# EasyEDA Pro project ProPrj_WatcheRobot2.0openSource_2026-06-17.epro, schematic 脚底充电板原理图
Assembly Variant: Basic; Board Name: Board1; Create Date: 2026-04-27; Page Name: P1; Project Name: WatcheRobot2.0; Schematic Name: Schematic3; Update Date: 2026-04-27; Company: 嘉立创EDA; Page Size: A4; Version: V1.0
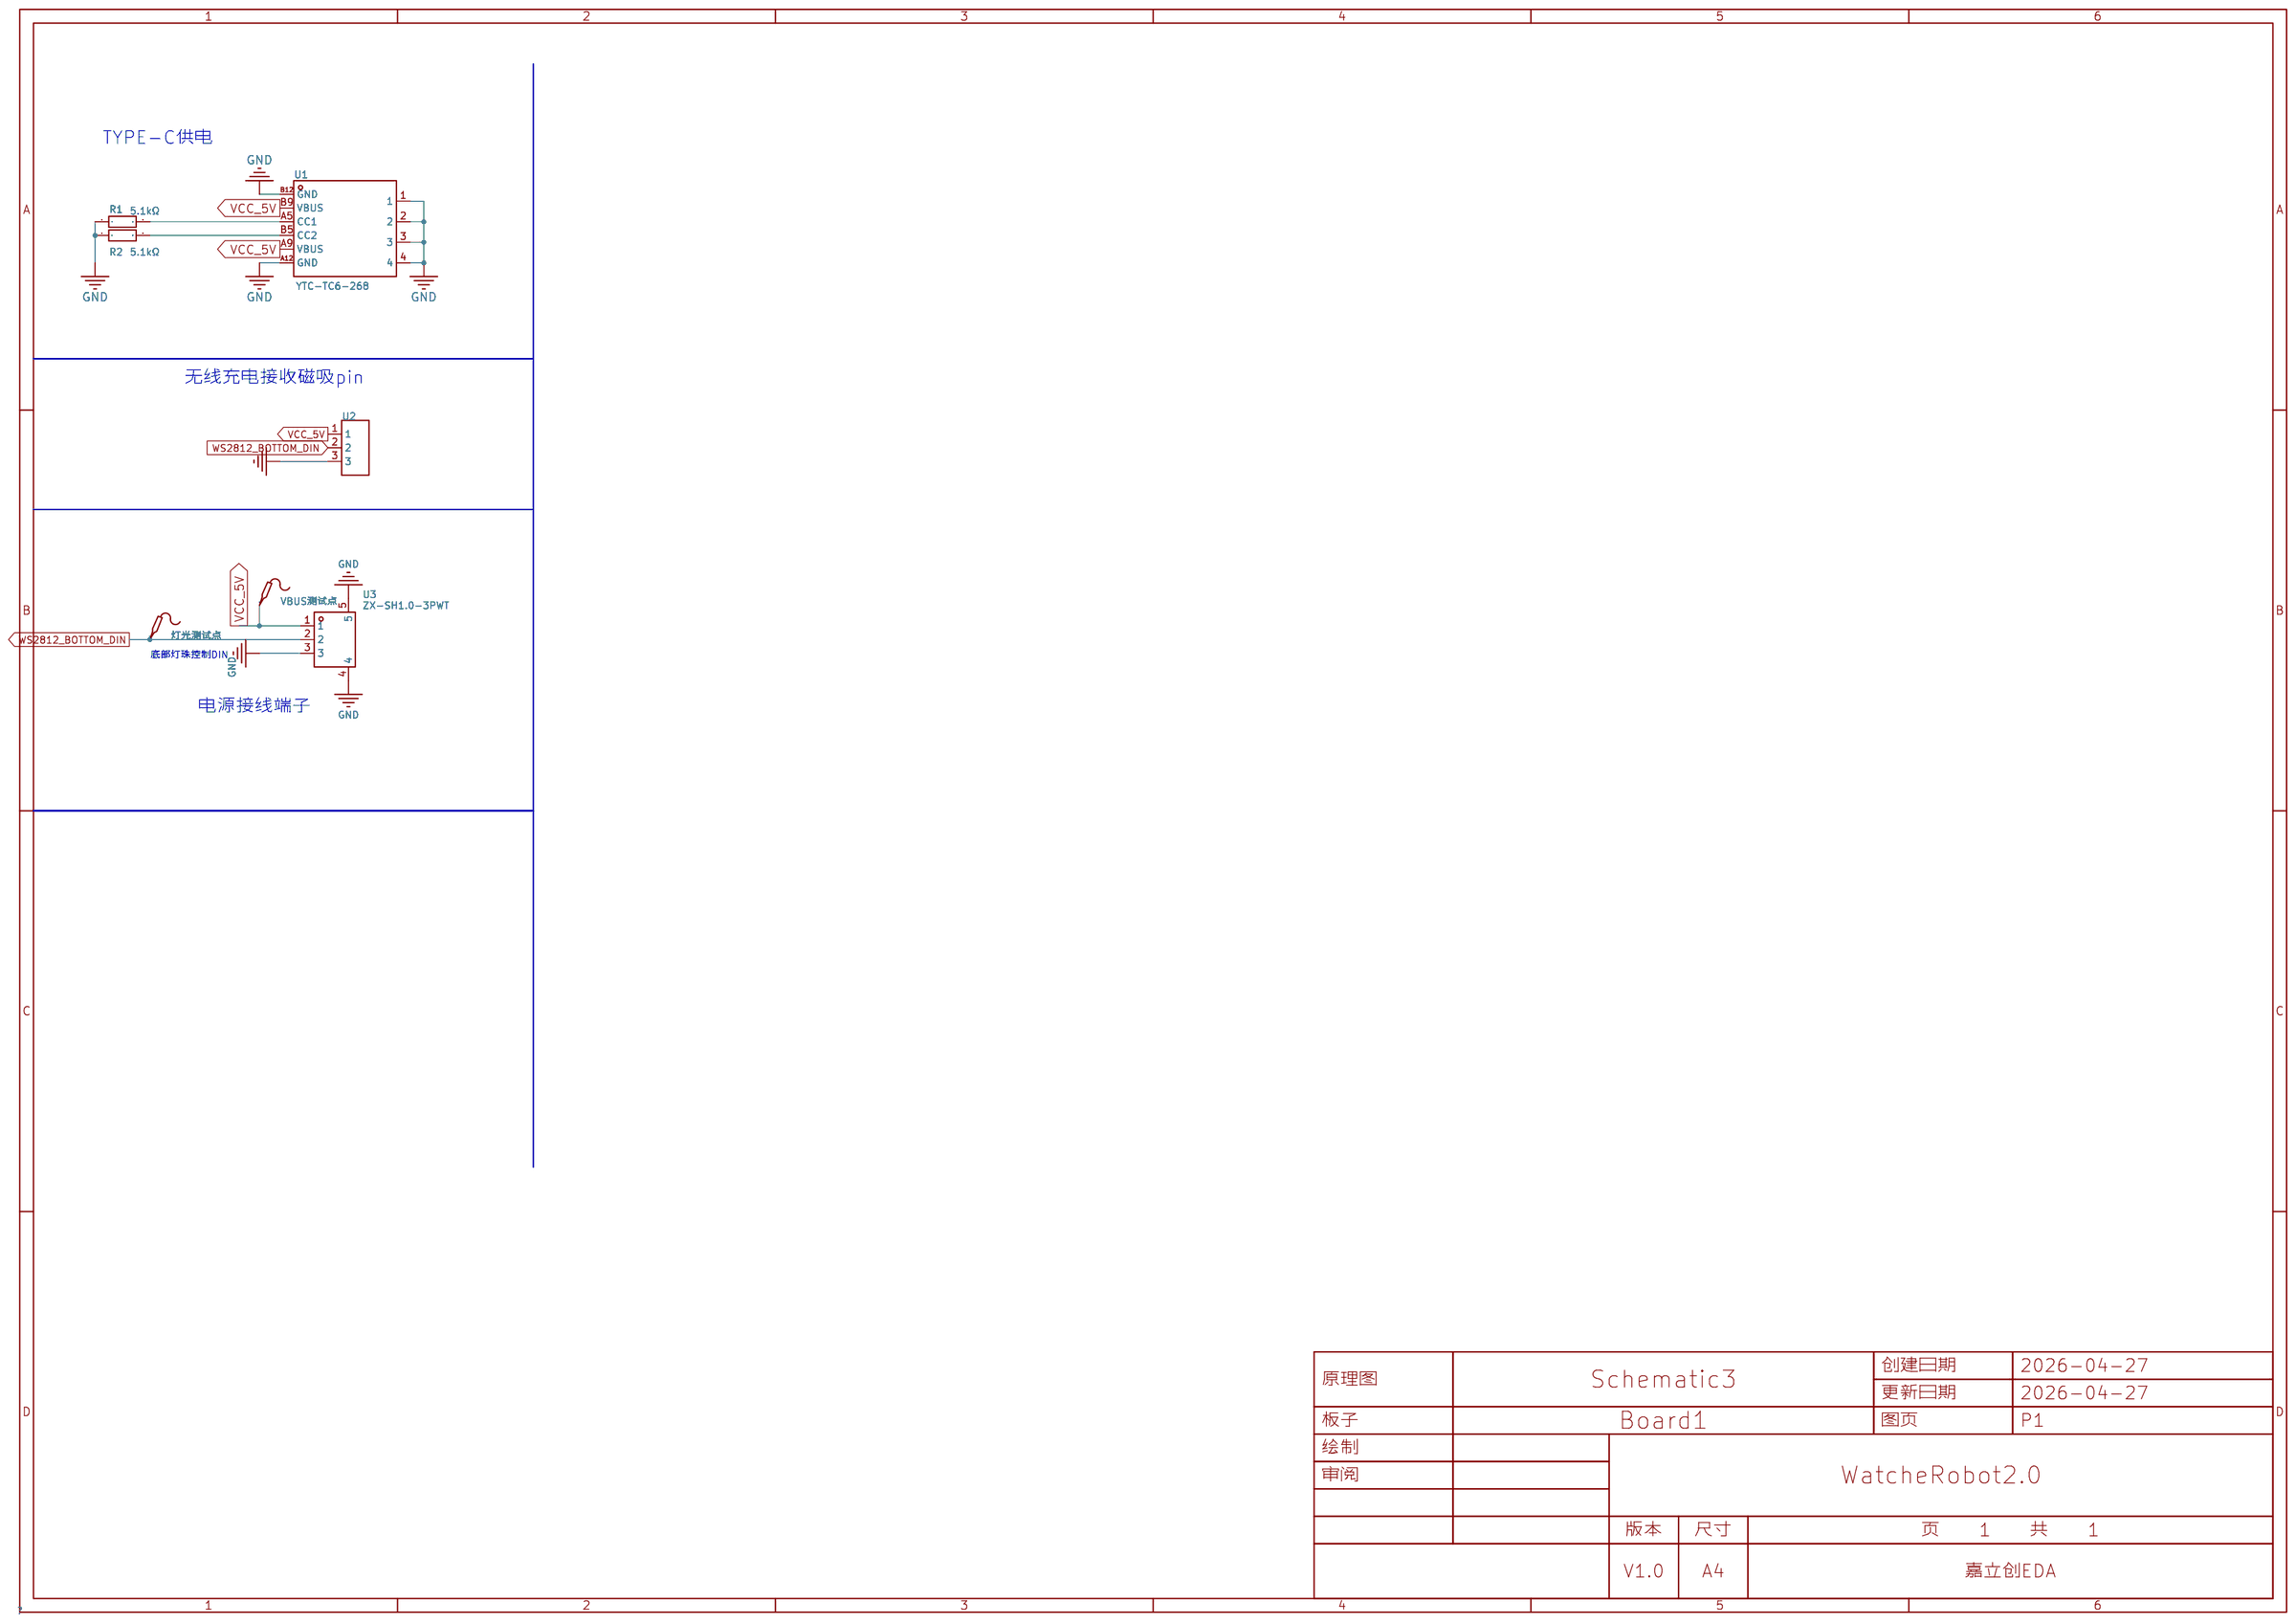
[diagram p0: schematic sheet]

## Parts
R1  5.1kΩ  [R0603_3]
R2  5.1kΩ  [R0603_3]
U1  YTC-TC6-268  [TYPE-C-SMD_YIYUAN_YTC-TC6-268]
U2  PR5L4015-3P-C-F  [CONN-TH_PR5L4015-3P-C-F]
U3  ZX-SH1.0-3PWT  [CONN-SMD_3P-P1.00_MEGASTAR_ZX-SH1.0-3PWT]
VBUS测试点  -  [Test-Point-0.5mm]
灯光测试点  -  [Test-Point-0.5mm]

## Library data of the parts
R1 R2 = 0603WAF5101T5E: 电阻类型:厚膜电阻;阻值:5.1kΩ;精度:±1%;功率:100mW;温度系数:±100ppm/;最大工作电压:75V;工作温度范围:-55~+155;; LCSC Part Name: 5.1kΩ ±1% 100mW; Supplier Part: C23186; Manufacturer: UNI-ROYAL(厚声); Supplier Footprint: 0603; JLCPCB Part Class: 基础库; Datasheet: https://atta.szlcsc.com/upload/public/pdf/source/20200306/C422600_1E6D84923E4A46A82E41ADD87F860B5C.pdf; Supplier: LCSC; Type: 厚膜电阻; Tolerance: ±1%; Power(Watts): 100mW; Temperature Coefficient: ±100ppm/; Overload Voltage (Max): 75V; Operating Temperature Range: -55~+155
U1 = YTC-TC6-268: 连接器类型:Type-C;公母:母座;触点数量:6;; LCSC Part Name: Type-C 母座; Supplier Part: C5260484; Manufacturer: YIYUAN(怡远); Supplier Footprint: SMD; JLCPCB Part Class: 扩展库; Datasheet: https://atta.szlcsc.com/upload/public/pdf/source/20221115/94102468E8C367463F1D717839C68408.pdf; Supplier: LCSC; Connector Type: Type-C; Gender: 母座; Number of Contacts: 6
U2 = PR5L4015-3P-C-F: 类型:弹簧顶针(POGO PIN);总PIN数:3P;间距:2.54mm;全长/全高:-;工作高度:-;接触电阻:-;弹性寿命:10000次;额定电流:2A;额定电压:12V;触头材质:黄铜;触头镀层:金;工作温度:-40℃~+85℃;; LCSC Part Name: 2.54-3P磁吸弹簧探针连接器母座POGOPIN适配PR5L5015-3P-C-H; Supplier Part: C41361290; Manufacturer: SAMZO(三佐); JLCPCB Part Class: Extended Part; Datasheet: https://item.szlcsc.com/datasheet/PR5L4015-3P-C-F/43105441.html; Supplier: LCSC; Type: 弹簧顶针(POGO PIN); Number of Pins: 3P; Pitch: 2.54mm; Elastic Life: 10000次; Current Rating: 2A; Voltage Rating: 12V; Contact Material: 黄铜; Contact Plating: 金; Operating Temperature: -40℃~+85℃
U3 = ZX-SH1.0-3PWT: 插针结构:1x3P;间距:1mm;安装方式:卧贴;参考系列:SH;总PIN数:3P;排数:1;每排PIN数:3;行距:-;额定电流:1A;触头材质:黄铜;触头镀层:锡;工作温度:-40℃~+85℃;; LCSC Part Name: 1x3P 间距:1mm 卧贴 系列:SH; Supplier Part: C7430445; Manufacturer: Megastar(兆星); Supplier Footprint: SMD,P=1mm,卧贴; JLCPCB Part Class: Extended Part; Datasheet: https://item.szlcsc.com/datasheet/ZX-SH1.0-3PWT/8430314.html; Supplier: LCSC; Pins Structure: 1x3P; Pitch: 1mm; Mounting Type: 卧贴; Reference Series: SH; Number of Pins: 3P; Number of Rows: 1; Number of PINs Per Row: 3; Current Rating: 1A; Contact Material: 黄铜; Contact Plating: 锡; Operating Temperature: -40℃~+85℃; Voltage Rating: 50V; Plastic Material: LCP; Supplementary Features: 辅助焊脚; Color: 米色; Z-Height of the Board: 3.15mm; X-Length of Bottom Edge on Board (Spacing Line): 5.35mm; Y-Width of Bottom Edge on Board: 4.3mm
VBUS测试点 灯光测试点 = Test-Point: Test Point 测试点

## Nets
GND: R1.1 R2.1 U1.1 U1.2 U1.3 U1.4 U1.A12(GND) U1.B12(GND) U2.3 U3.3 U3.4 U3.5
VCC_5V: U1.A9(VBUS) U1.B9(VBUS) U2.1 U3.1 VBUS测试点.1
WS2812_BOTTOM_DIN: U2.2 U3.2 灯光测试点.1
$1N31: R2.2 U1.B5(CC2)
$1N32: R1.2 U1.A5(CC1)

## Notes on the sheet
- TYPE-C供电
- 无线充电接收磁吸pin
- 底部灯珠控制DIN
- 电源接线端子
